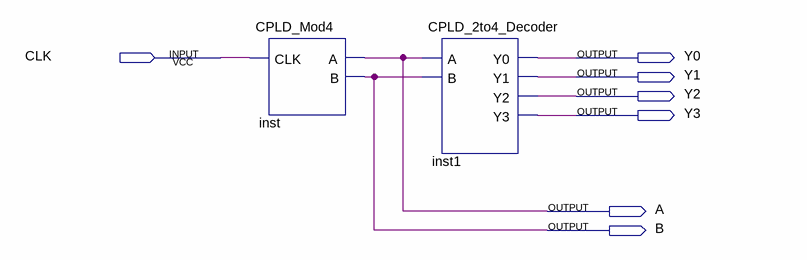
[diagram p0: schematic sheet]
// Quartus schematic CPLD_scan4.bdf as structural Verilog: 2 symbols, 7 pins
module CPLD_scan4 (
  input  CLK,
  output Y0,
  output Y1,
  output Y2,
  output Y3,
  output A,
  output B
);

  CPLD_Mod4 inst (.CLK(CLK), .A(A), .B(B));
  CPLD_2to4_Decoder inst1 (.A(A), .B(B), .Y0(Y0), .Y1(Y1), .Y2(Y2), .Y3(Y3));
endmodule
